# EAGLE schematic Mainboard (EAGLE 6.6.0)

## Sheet 1 of 4
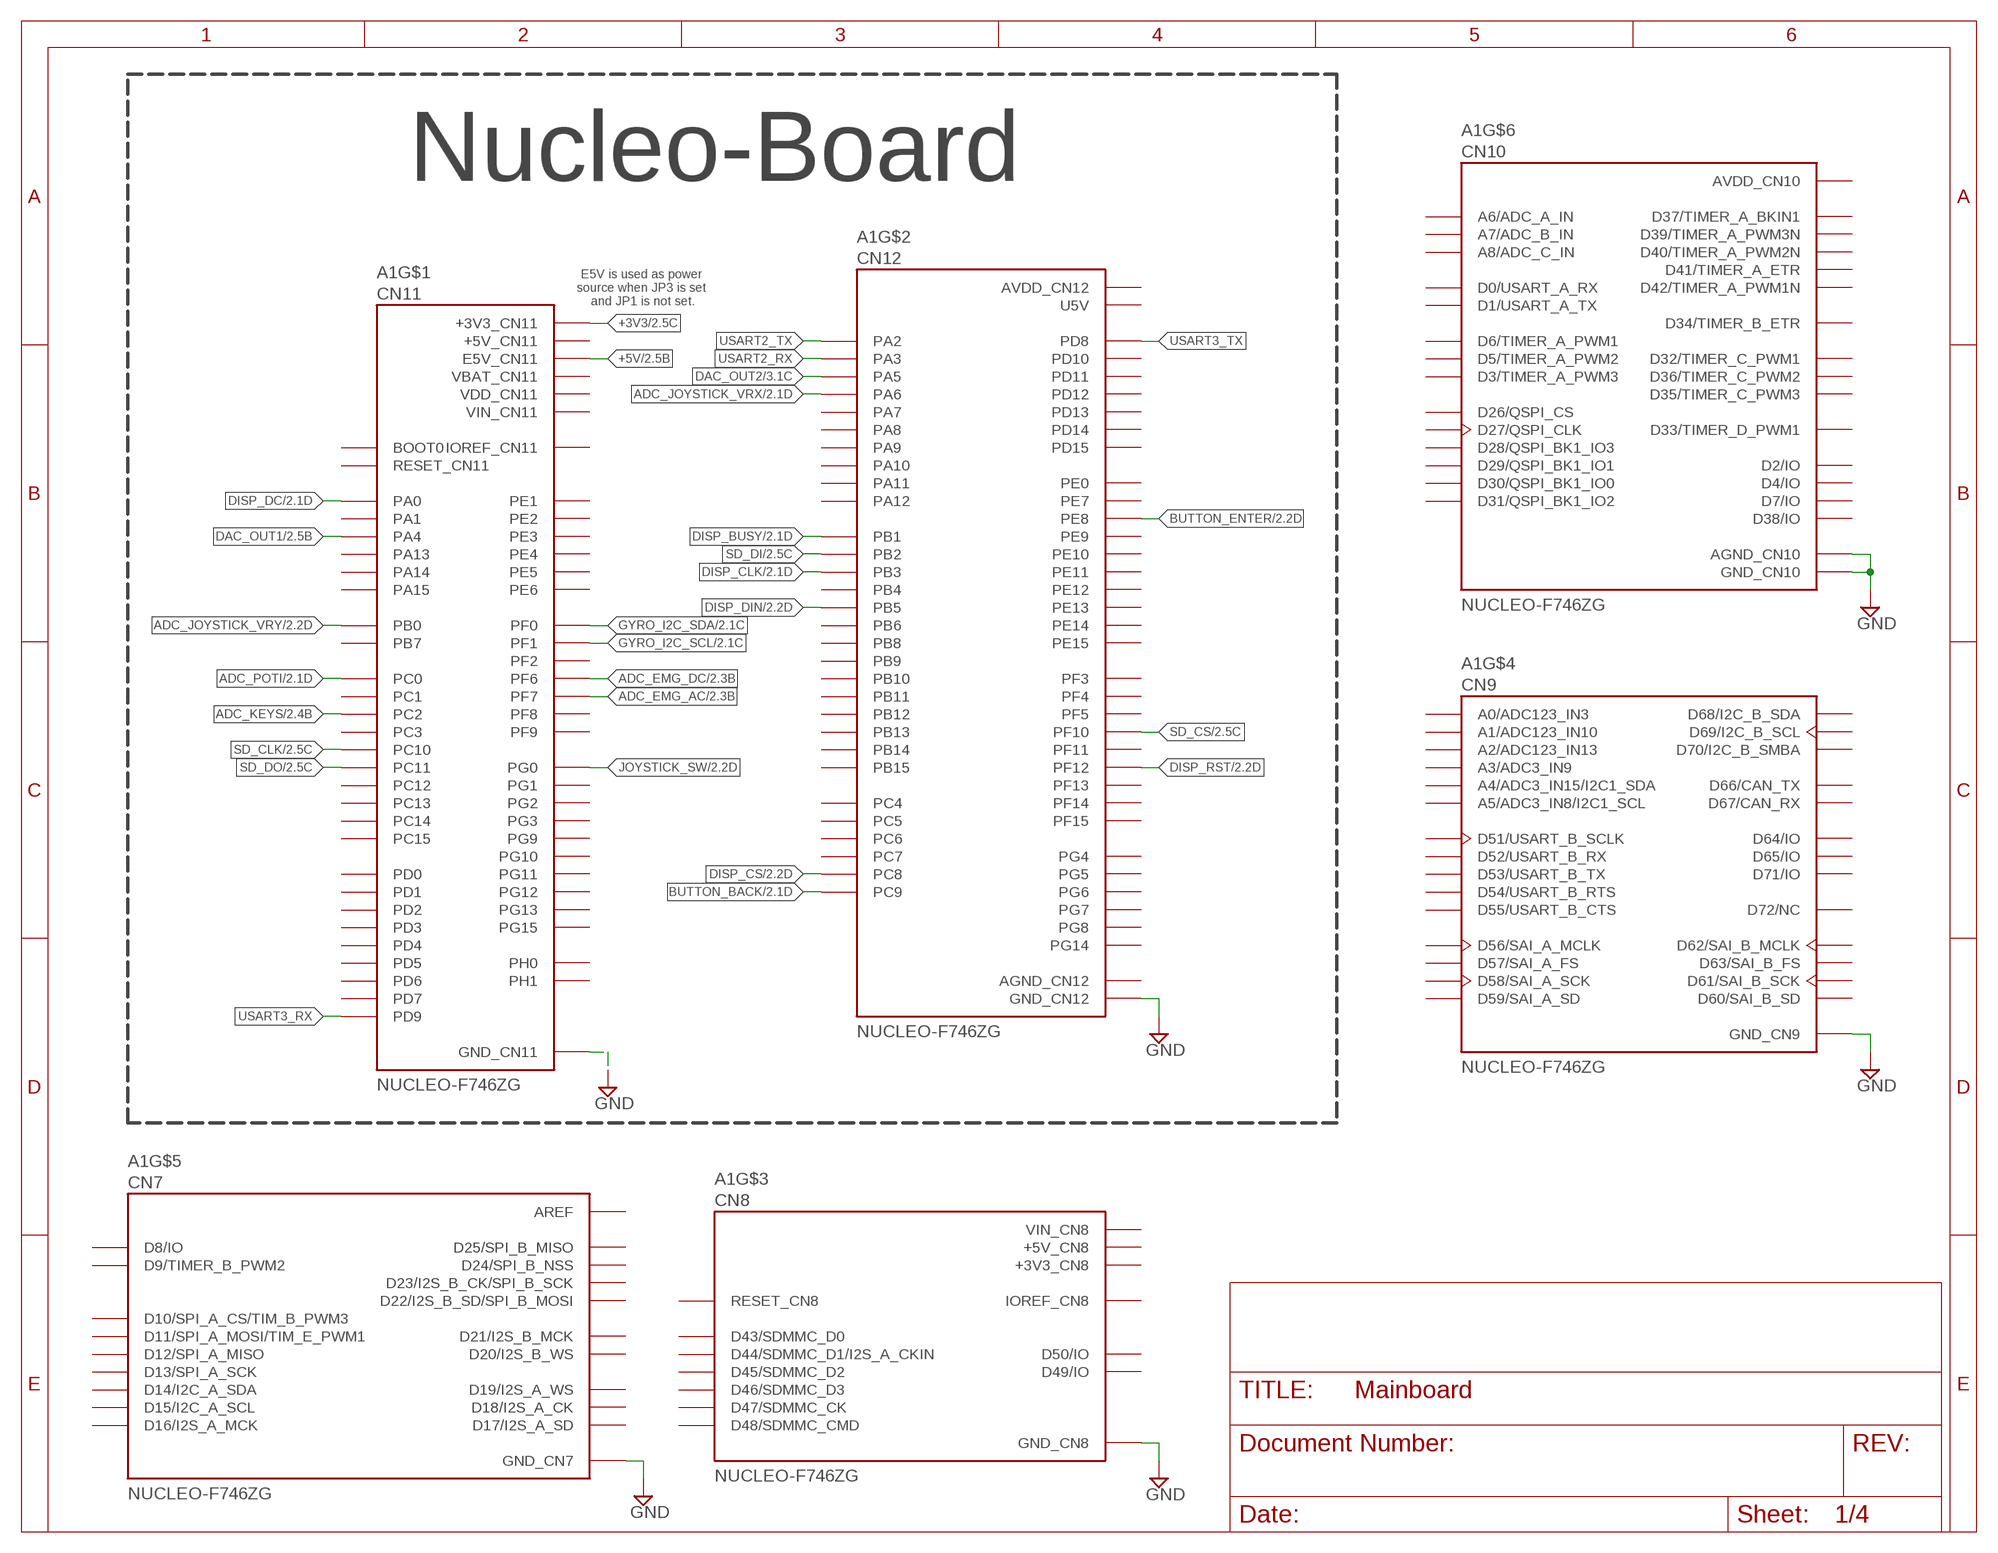
[diagram p0: schematic, sheet 1]

### Parts
A1  NUCLEO-F746ZG  [MODULE_NUCLEO-F746ZG]

### Nets
+3V3: A1.CN11_16(+3V3_CN11) ; also sheet 2,4
+5V: A1.CN11_6(E5V_CN11) ; also sheet 2,3,4
ADC_EMG_AC: A1.CN11_11(PF7) ; also sheet 2
ADC_EMG_DC: A1.CN11_9(PF6) ; also sheet 2
ADC_JOYSTICK_VRX: A1.CN12_13(PA6) ; also sheet 2,4
ADC_JOYSTICK_VRY: A1.CN11_34(PB0) ; also sheet 2,4
ADC_KEYS: A1.CN11_35(PC2) ; also sheet 2
ADC_POTI: A1.CN11_38(PC0) ; also sheet 2,4
BUTTON_BACK: A1.CN12_1(PC9) ; also sheet 2
BUTTON_ENTER: A1.CN12_40(PE8) ; also sheet 2
DAC_OUT1: A1.CN11_32(PA4) ; also sheet 2,3
DAC_OUT2: A1.CN12_11(PA5) ; also sheet 3
DISP_BUSY: A1.CN12_24(PB1) ; also sheet 2
DISP_CLK: A1.CN12_31(PB3) ; also sheet 2
DISP_CS: A1.CN12_2(PC8) ; also sheet 2
DISP_DC: A1.CN11_28(PA0) ; also sheet 2
DISP_DIN: A1.CN12_29(PB5) ; also sheet 2
DISP_RST: A1.CN12_59(PF12) ; also sheet 2
GND: A1.CN7_8(GND_CN7) A1.CN8_11(GND_CN8) A1.CN8_13(GND_CN8) A1.CN9_12(GND_CN9) A1.CN9_23(GND_CN9) A1.CN10_3(AGND_CN10) A1.CN10_5(GND_CN10) A1.CN10_17(GND_CN10) A1.CN10_22(GND_CN10) A1.CN10_27(GND_CN10) A1.CN11_8(GND_CN11) A1.CN11_19(GND_CN11) A1.CN11_20(GND_CN11) A1.CN11_22(GND_CN11) A1.CN11_49(GND_CN11) A1.CN11_60(GND_CN11) A1.CN11_71(GND_CN11) A1.CN11_72(GND_CN11) A1.CN12_9(GND_CN12) A1.CN12_20(GND_CN12) A1.CN12_39(GND_CN12) A1.CN12_54(GND_CN12) A1.CN12_63(GND_CN12) A1.CN12_71(GND_CN12) A1.CN12_72(GND_CN12) ; also sheet 2,3,4
GYRO_I2C_SCL: A1.CN11_51(PF1) ; also sheet 2
GYRO_I2C_SDA: A1.CN11_53(PF0) ; also sheet 2
JOYSTICK_SW: A1.CN11_59(PG0) ; also sheet 2
SD_CLK: A1.CN11_1(PC10) ; also sheet 2
SD_CS: A1.CN12_42(PF10) ; also sheet 2
SD_DI: A1.CN12_22(PB2) ; also sheet 2
SD_DO: A1.CN11_2(PC11) ; also sheet 2
USART2_RX: A1.CN12_37(PA3)
USART2_TX: A1.CN12_35(PA2)
USART3_RX: A1.CN11_69(PD9)
USART3_TX: A1.CN12_10(PD8)
Unconnected: A1.CN7_1(D16/I2S_A_MCK) A1.CN7_2(D15/I2C_A_SCL) A1.CN7_3(D17/I2S_A_SD) A1.CN7_4(D14/I2C_A_SDA) A1.CN7_5(D18/I2S_A_CK) A1.CN7_7(D19/I2S_A_WS) A1.CN7_9(D20/I2S_B_WS) A1.CN7_10(D13/SPI_A_SCK) A1.CN7_11(D21/I2S_B_MCK) A1.CN7_12(D12/SPI_A_MISO) A1.CN7_13(D22/I2S_B_SD/SPI_B_MOSI) A1.CN7_14(D11/SPI_A_MOSI/TIM_E_PWM1) A1.CN7_15(D23/I2S_B_CK/SPI_B_SCK) A1.CN7_16(D10/SPI_A_CS/TIM_B_PWM3) A1.CN7_17(D24/SPI_B_NSS) A1.CN7_18(D9/TIMER_B_PWM2) A1.CN7_19(D25/SPI_B_MISO) A1.CN7_20(D8/IO) A1.CN8_2(D43/SDMMC_D0) A1.CN8_3(IOREF_CN8) A1.CN8_4(D44/SDMMC_D1/I2S_A_CKIN) A1.CN8_5(RESET_CN8) A1.CN8_6(D45/SDMMC_D2) A1.CN8_8(D46/SDMMC_D3) A1.CN8_10(D47/SDMMC_CK) A1.CN8_12(D48/SDMMC_CMD) A1.CN8_14(D49/IO) A1.CN8_16(D50/IO) A1.CN9_1(A0/ADC123_IN3) A1.CN9_2(D51/USART_B_SCLK) A1.CN9_3(A1/ADC123_IN10) A1.CN9_4(D52/USART_B_RX) A1.CN9_5(A2/ADC123_IN13) A1.CN9_6(D53/USART_B_TX) A1.CN9_7(A3/ADC3_IN9) A1.CN9_8(D54/USART_B_RTS) A1.CN9_9(A4/ADC3_IN15/I2C1_SDA) A1.CN9_10(D55/USART_B_CTS) A1.CN9_11(A5/ADC3_IN8/I2C1_SCL) A1.CN9_13(D72/NC) A1.CN9_14(D56/SAI_A_MCLK) A1.CN9_15(D71/IO) A1.CN9_16(D57/SAI_A_FS) A1.CN9_17(D70/I2C_B_SMBA) A1.CN9_18(D58/SAI_A_SCK) A1.CN9_19(D69/I2C_B_SCL) A1.CN9_20(D59/SAI_A_SD) A1.CN9_21(D68/I2C_B_SDA) A1.CN9_22(D60/SAI_B_SD) A1.CN9_24(D61/SAI_B_SCK) A1.CN9_25(D67/CAN_RX) A1.CN9_26(D62/SAI_B_MCLK) A1.CN9_27(D66/CAN_TX) A1.CN9_28(D63/SAI_B_FS) A1.CN9_29(D65/IO) A1.CN9_30(D64/IO) A1.CN10_2(D7/IO) A1.CN10_4(D6/TIMER_A_PWM1) A1.CN10_6(D5/TIMER_A_PWM2) A1.CN10_7(A6/ADC_A_IN) A1.CN10_8(D4/IO) A1.CN10_9(A7/ADC_B_IN) A1.CN10_10(D3/TIMER_A_PWM3) A1.CN10_11(A8/ADC_C_IN) A1.CN10_12(D2/IO) A1.CN10_13(D26/QSPI_CS) A1.CN10_14(D1/USART_A_TX) A1.CN10_15(D27/QSPI_CLK) A1.CN10_16(D0/USART_A_RX) A1.CN10_18(D42/TIMER_A_PWM1N) A1.CN10_19(D28/QSPI_BK1_IO3) A1.CN10_20(D41/TIMER_A_ETR) A1.CN10_21(D29/QSPI_BK1_IO1) A1.CN10_23(D30/QSPI_BK1_IO0) A1.CN10_24(D40/TIMER_A_PWM2N) A1.CN10_25(D31/QSPI_BK1_IO2) A1.CN10_26(D39/TIMER_A_PWM3N) A1.CN10_28(D38/IO) A1.CN10_29(D32/TIMER_C_PWM1) A1.CN10_30(D37/TIMER_A_BKIN1) A1.CN10_31(D33/TIMER_D_PWM1) A1.CN10_32(D36/TIMER_C_PWM2) A1.CN10_33(D34/TIMER_B_ETR) A1.CN10_34(D35/TIMER_C_PWM3) A1.CN11_3(PC12) A1.CN11_4(PD2) A1.CN11_7(BOOT0) A1.CN11_12(IOREF_CN11) A1.CN11_13(PA13) A1.CN11_14(RESET_CN11) A1.CN11_15(PA14) A1.CN11_17(PA15) A1.CN11_21(PB7) A1.CN11_23(PC13) A1.CN11_25(PC14) A1.CN11_27(PC15) A1.CN11_29(PH0) A1.CN11_30(PA1) A1.CN11_31(PH1) A1.CN11_36(PC1) A1.CN11_37(PC3) A1.CN11_39(PD4) A1.CN11_40(PD3) A1.CN11_41(PD5) A1.CN11_42(PG2) A1.CN11_43(PD6) A1.CN11_44(PG3) A1.CN11_45(PD7) A1.CN11_46(PE2) A1.CN11_47(PE3) A1.CN11_48(PE4) A1.CN11_50(PE5) A1.CN11_52(PF2) A1.CN11_54(PF8) A1.CN11_55(PD1) A1.CN11_56(PF9) A1.CN11_57(PD0) A1.CN11_58(PG1) A1.CN11_61(PE1) A1.CN11_62(PE6) A1.CN11_63(PG9) A1.CN11_64(PG15) A1.CN11_65(PG12) A1.CN11_66(PG10) A1.CN11_68(PG13) A1.CN11_70(PG11) A1.CN12_3(PB8) A1.CN12_4(PC6) A1.CN12_5(PB9) A1.CN12_6(PC5) A1.CN12_12(PA12) A1.CN12_14(PA11) A1.CN12_15(PA7) A1.CN12_16(PB12) A1.CN12_17(PB6) A1.CN12_18(PB11) A1.CN12_19(PC7) A1.CN12_21(PA9) A1.CN12_23(PA8) A1.CN12_25(PB10) A1.CN12_26(PB15) A1.CN12_27(PB4) A1.CN12_28(PB14) A1.CN12_30(PB13) A1.CN12_33(PA10) A1.CN12_34(PC4) A1.CN12_36(PF5) A1.CN12_38(PF4) A1.CN12_41(PD13) A1.CN12_43(PD12) A1.CN12_44(PE7) A1.CN12_45(PD11) A1.CN12_46(PD14) A1.CN12_47(PE10) A1.CN12_48(PD15) A1.CN12_49(PE12) A1.CN12_50(PF14) A1.CN12_51(PE14) A1.CN12_52(PE9) A1.CN12_53(PE15) A1.CN12_55(PE13) A1.CN12_56(PE11) A1.CN12_57(PF13) A1.CN12_58(PF3) A1.CN12_60(PF15) A1.CN12_61(PG14) A1.CN12_62(PF11) A1.CN12_64(PE0) A1.CN12_65(PD10) A1.CN12_66(PG8) A1.CN12_67(PG7) A1.CN12_68(PG5) A1.CN12_69(PG4) A1.CN12_70(PG6)

### Notes on the sheet
- Nucleo-Board
- E5V is used as power 
  source when JP3 is set 
  and JP1 is not set.

## Sheet 2 of 4
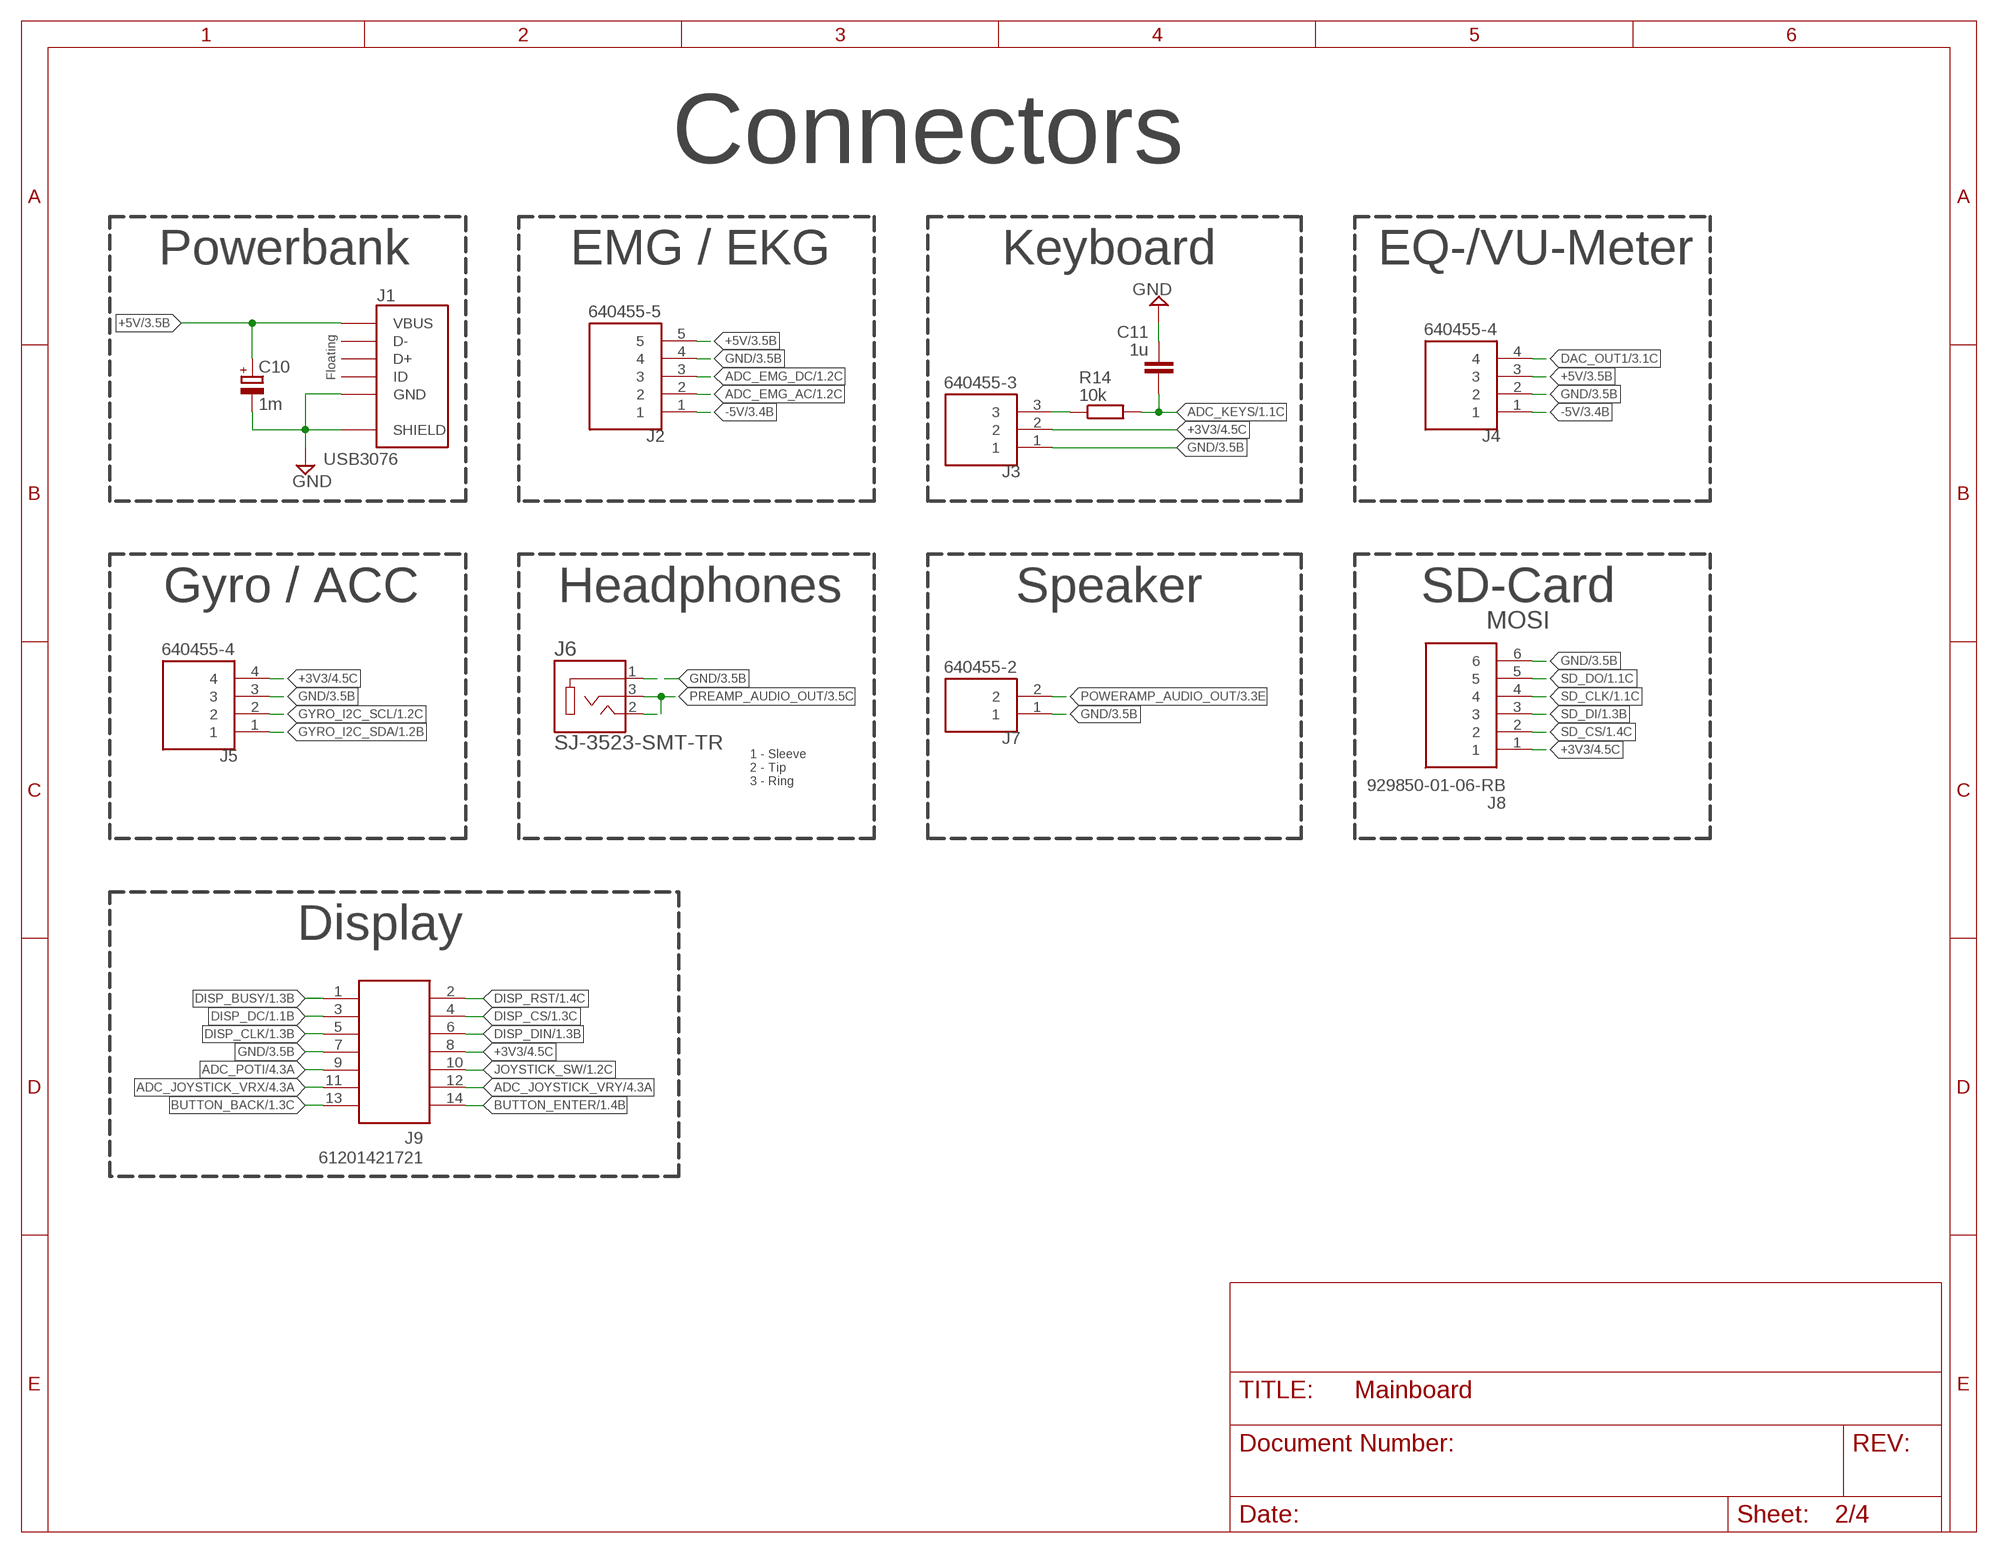
[diagram p1: schematic, sheet 2]

### Parts
C10  1m  CPOL-EUE2.5-5  [E2,5-5]
C11  1u  C-EUC0603  [C0603]
J1  USB3076  USB3076-XX-X_REVC  [GCT_USB3076-XX-X_REVC]
J2  640455-5  [TE_640455-5]
J3  640455-3  [TE_640455-3]
J4  640455-4  [TE_640455-4]
J5  640455-4  [TE_640455-4]
J6  SJ-3523-SMT-TR  [CUI_SJ-3523-SMT-TR]
J7  640455-2  [TE_640455-2]
J8  929850-01-06-RB  [RHDR6W76P0X254_1X6_1524X254X82]
J9  61201421721  [61201421721]
R14  10k  R-EU_R0603  [R0603]

### Nets
+3V3: J3.2 J5.4 J8.1 J9.8 ; also sheet 1,4
+5V: C10.+ J1.1(VBUS) J2.5 J4.3 ; also sheet 1,3,4
-5V: J2.1 J4.1 ; also sheet 3,4
ADC_EMG_AC: J2.2 ; also sheet 1
ADC_EMG_DC: J2.3 ; also sheet 1
ADC_JOYSTICK_VRX: J9.11 ; also sheet 1,4
ADC_JOYSTICK_VRY: J9.12 ; also sheet 1,4
ADC_KEYS: C11.1 R14.2 ; also sheet 1
ADC_POTI: J9.9 ; also sheet 1,4
BUTTON_BACK: J9.13 ; also sheet 1
BUTTON_ENTER: J9.14 ; also sheet 1
DAC_OUT1: J4.4 ; also sheet 1,3
DISP_BUSY: J9.1 ; also sheet 1
DISP_CLK: J9.5 ; also sheet 1
DISP_CS: J9.4 ; also sheet 1
DISP_DC: J9.3 ; also sheet 1
DISP_DIN: J9.6 ; also sheet 1
DISP_RST: J9.2 ; also sheet 1
GND: C10.- C11.2 J1.5(GND) J1.6(SHIELD) J1.7(SHIELD) J1.8(SHIELD) J1.9(SHIELD) J1.10(SHIELD) J1.11(SHIELD) J2.4 J3.1 J4.2 J5.3 J6.1 J7.1 J8.6 J9.7 ; also sheet 1,3,4
GYRO_I2C_SCL: J5.2 ; also sheet 1
GYRO_I2C_SDA: J5.1 ; also sheet 1
JOYSTICK_SW: J9.10 ; also sheet 1
N$1: J3.3 R14.1
POWERAMP_AUDIO_OUT: J7.2 ; also sheet 3
PREAMP_AUDIO_OUT: J6.2 J6.3 ; also sheet 3
SD_CLK: J8.4 ; also sheet 1
SD_CS: J8.2 ; also sheet 1
SD_DI: J8.3 ; also sheet 1
SD_DO: J8.5 ; also sheet 1
Unconnected: J1.2(D-) J1.3(D+) J1.4(ID)

### Notes on the sheet
- Connectors
- Powerbank | EMG / EKG | Keyboard | EQ-/VU-Meter
- Floating
- Gyro / ACC | Headphones | Speaker | SD-Card
- MOSI
- 1 - Sleeve
  2 - Tip
  3 - Ring
- Display

## Sheet 3 of 4
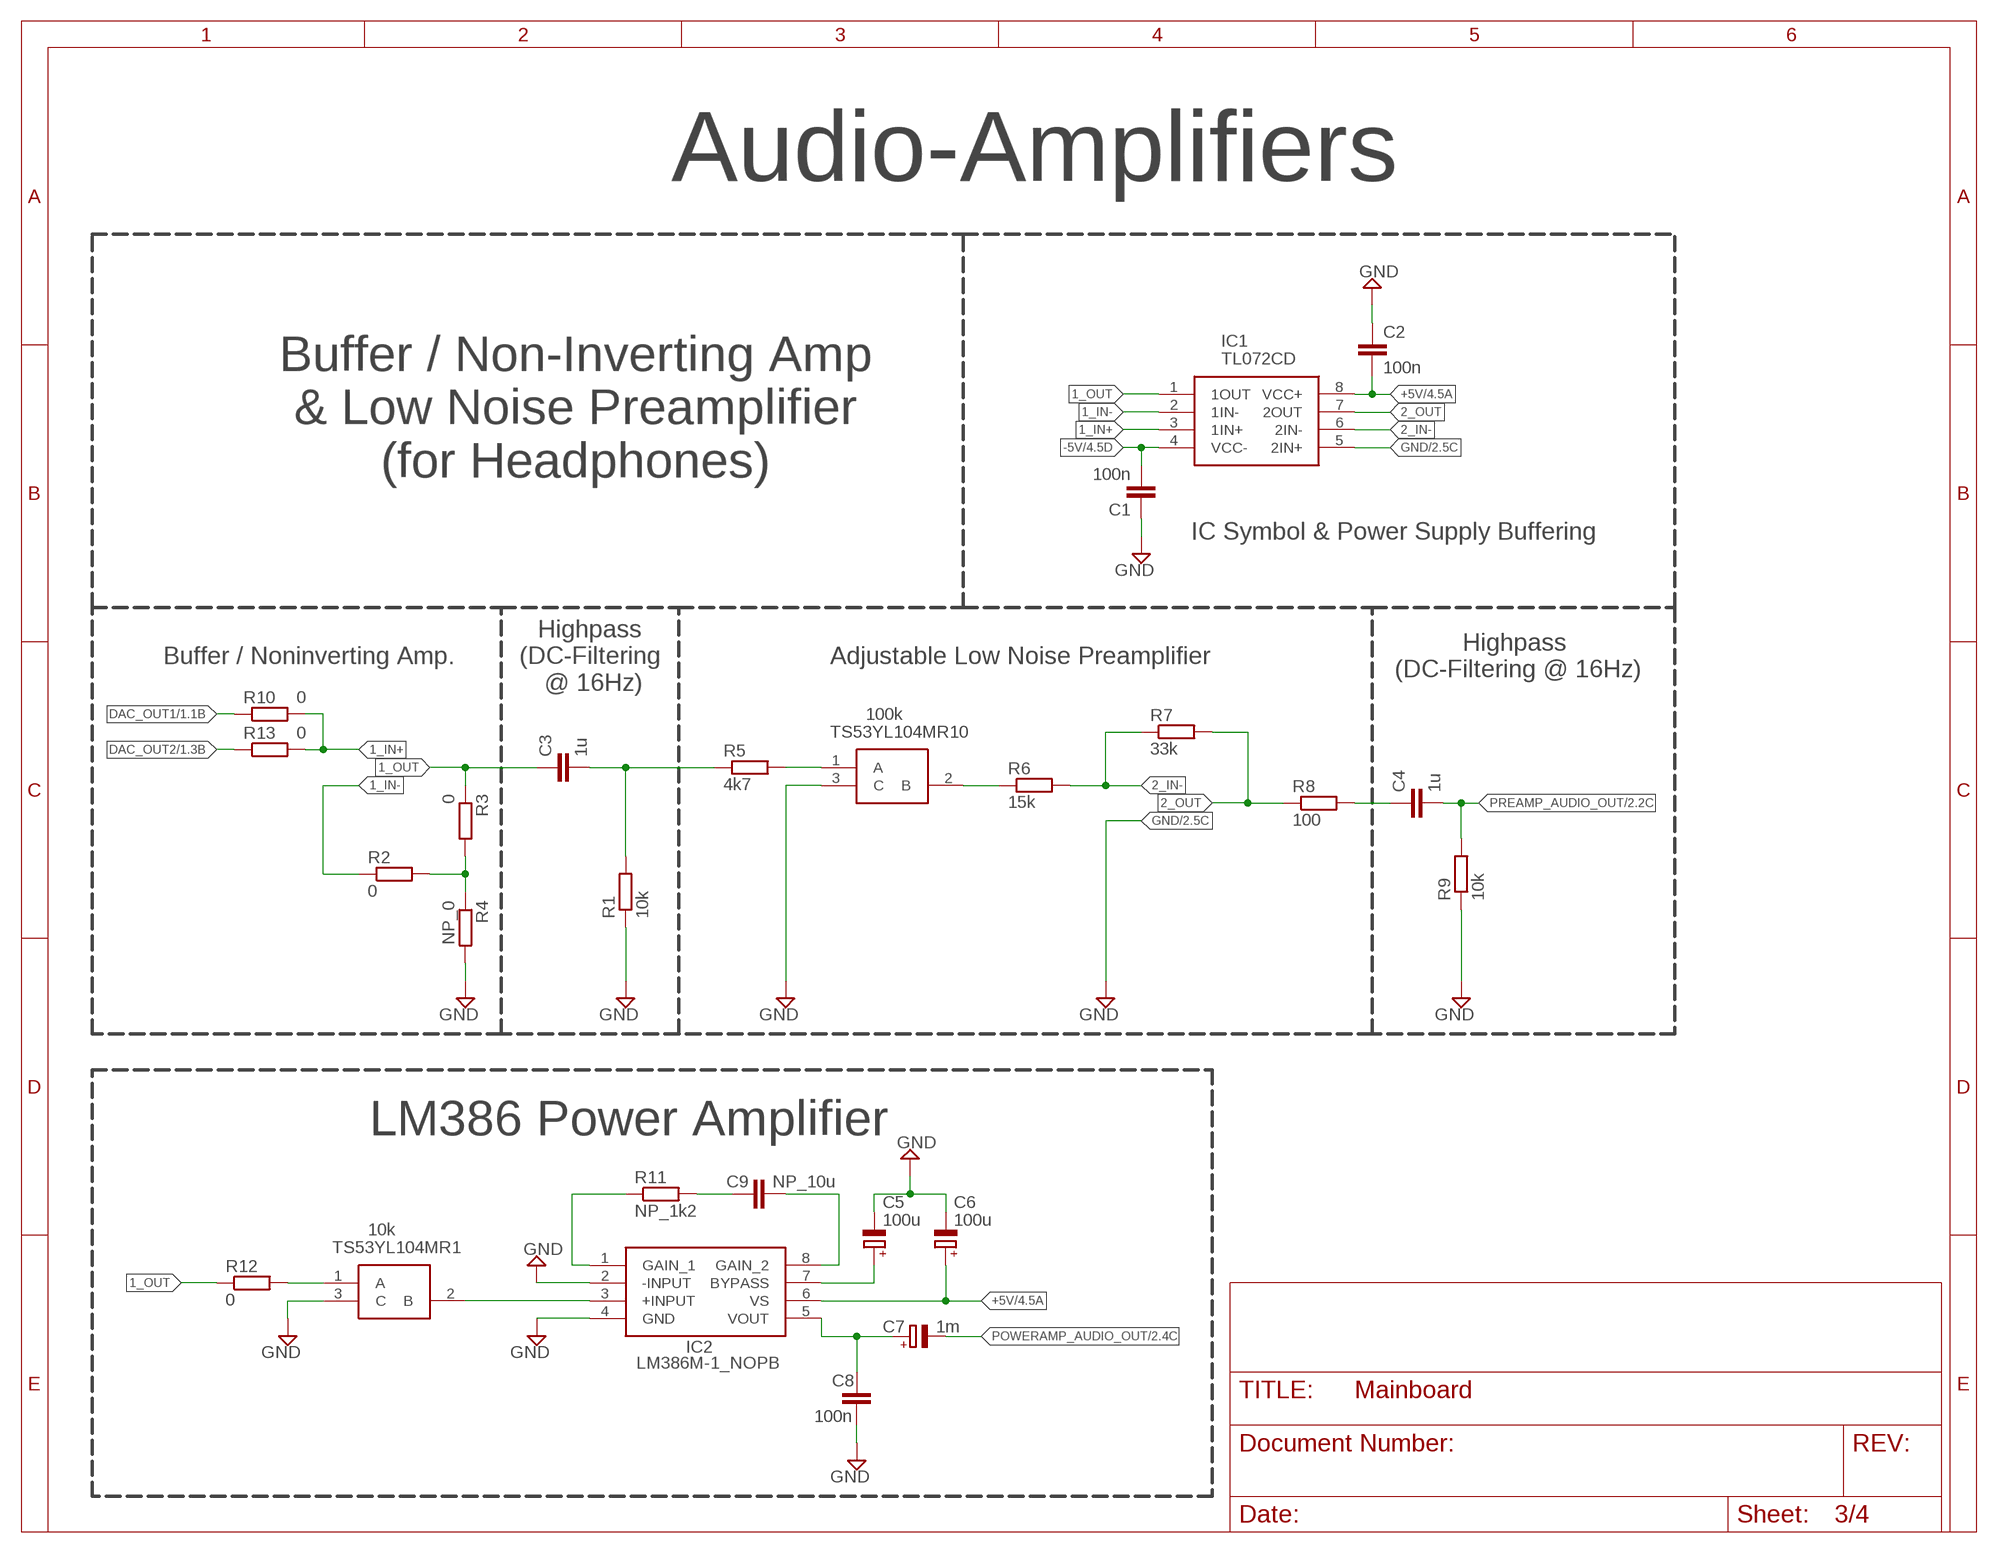
[diagram p2: schematic, sheet 3]

### Parts
C1  100n  C-EUC0603  [C0603]
C2  100n  C-EUC0603  [C0603]
C3  1u  C-EUC0603  [C0603]
C4  1u  C-EUC0603  [C0603]
C5  100u  CPOL-EUE2.5-5  [E2,5-5]
C6  100u  CPOL-EUE2.5-5  [E2,5-5]
C7  1m  CPOL-EUE2.5-5  [E2,5-5]
C8  100n  C-EUC0603  [C0603]
C9  NP_10u  C-EUC0603  [C0603]
IC1  TL072CD  [SOIC127P600X175-8N]
IC2  LM386M-1_NOPB  [SOIC127P600X175-8N]
R1  10k  R-EU_R0603  [R0603]
R2  0  R-EU_R0603  [R0603]
R3  0  R-EU_R0603  [R0603]
R4  NP_0  R-EU_R0603  [R0603]
R5  4k7  R-EU_R0603  [R0603]
R6  15k  R-EU_R0603  [R0603]
R7  33k  R-EU_R0603  [R0603]
R8  100  R-EU_R0603  [R0603]
R9  10k  R-EU_R0603  [R0603]
R10  0  R-EU_R0603  [R0603]
R11  NP_1k2  R-EU_R0603  [R0603]
R12  0  R-EU_R0603  [R0603]
R13  0  R-EU_R0603  [R0603]
TS53YL104MR1  10k  TS53YL203MR10  [TS53YL203MR10]
TS53YL104MR10  100k  TS53YL203MR10  [TS53YL203MR10]

### Nets
1_IN+: IC1.3(1IN+) R10.2 R13.2
1_IN-: IC1.2(1IN-) R2.1
1_OUT: C3.1 IC1.1(1OUT) R3.1 R12.1
2_IN-: IC1.6(2IN-) R6.2 R7.1
2_OUT: IC1.7(2OUT) R7.2 R8.1
+5V: C2.2 C6.+ IC1.8(VCC+) IC2.6(VS) ; also sheet 1,2,4
-5V: C1.2 IC1.4(VCC-) ; also sheet 2,4
DAC_OUT1: R10.1 ; also sheet 1,2
DAC_OUT2: R13.1 ; also sheet 1
GND: C1.1 C2.1 C5.- C6.- C8.2 IC1.5(2IN+) IC2.2(-INPUT) IC2.4(GND) R1.1 R4.2 R9.1 TS53YL104MR1.3(C) TS53YL104MR10.3(C) ; also sheet 1,2,4
N$2: C3.2 R1.2 R5.1
N$19: R2.2 R3.2 R4.1
N$20: R5.2 TS53YL104MR10.1(A)
N$21: R6.1 TS53YL104MR10.2(B)
N$22: C4.1 R8.2
N$23: IC2.1(GAIN_1) R11.1
N$24: IC2.3(+INPUT) TS53YL104MR1.2(B)
N$25: C9.1 R11.2
N$26: C9.2 IC2.8(GAIN_2)
N$27: R12.2 TS53YL104MR1.1(A)
N$28: C5.+ IC2.7(BYPASS)
N$29: C7.+ C8.1 IC2.5(VOUT)
POWERAMP_AUDIO_OUT: C7.- ; also sheet 2
PREAMP_AUDIO_OUT: C4.2 R9.2 ; also sheet 2

### Notes on the sheet
- Audio-Amplifiers
- Buffer / Non-Inverting Amp
  & Low Noise Preamplifier
  (for Headphones)
- IC Symbol & Power Supply Buffering
- Buffer / Noninverting Amp.
- Highpass 
  (DC-Filtering 
  @ 16Hz)
- Adjustable Low Noise Preamplifier
- Highpass 
  (DC-Filtering @ 16Hz)
- LM386 Power Amplifier

## Sheet 4 of 4
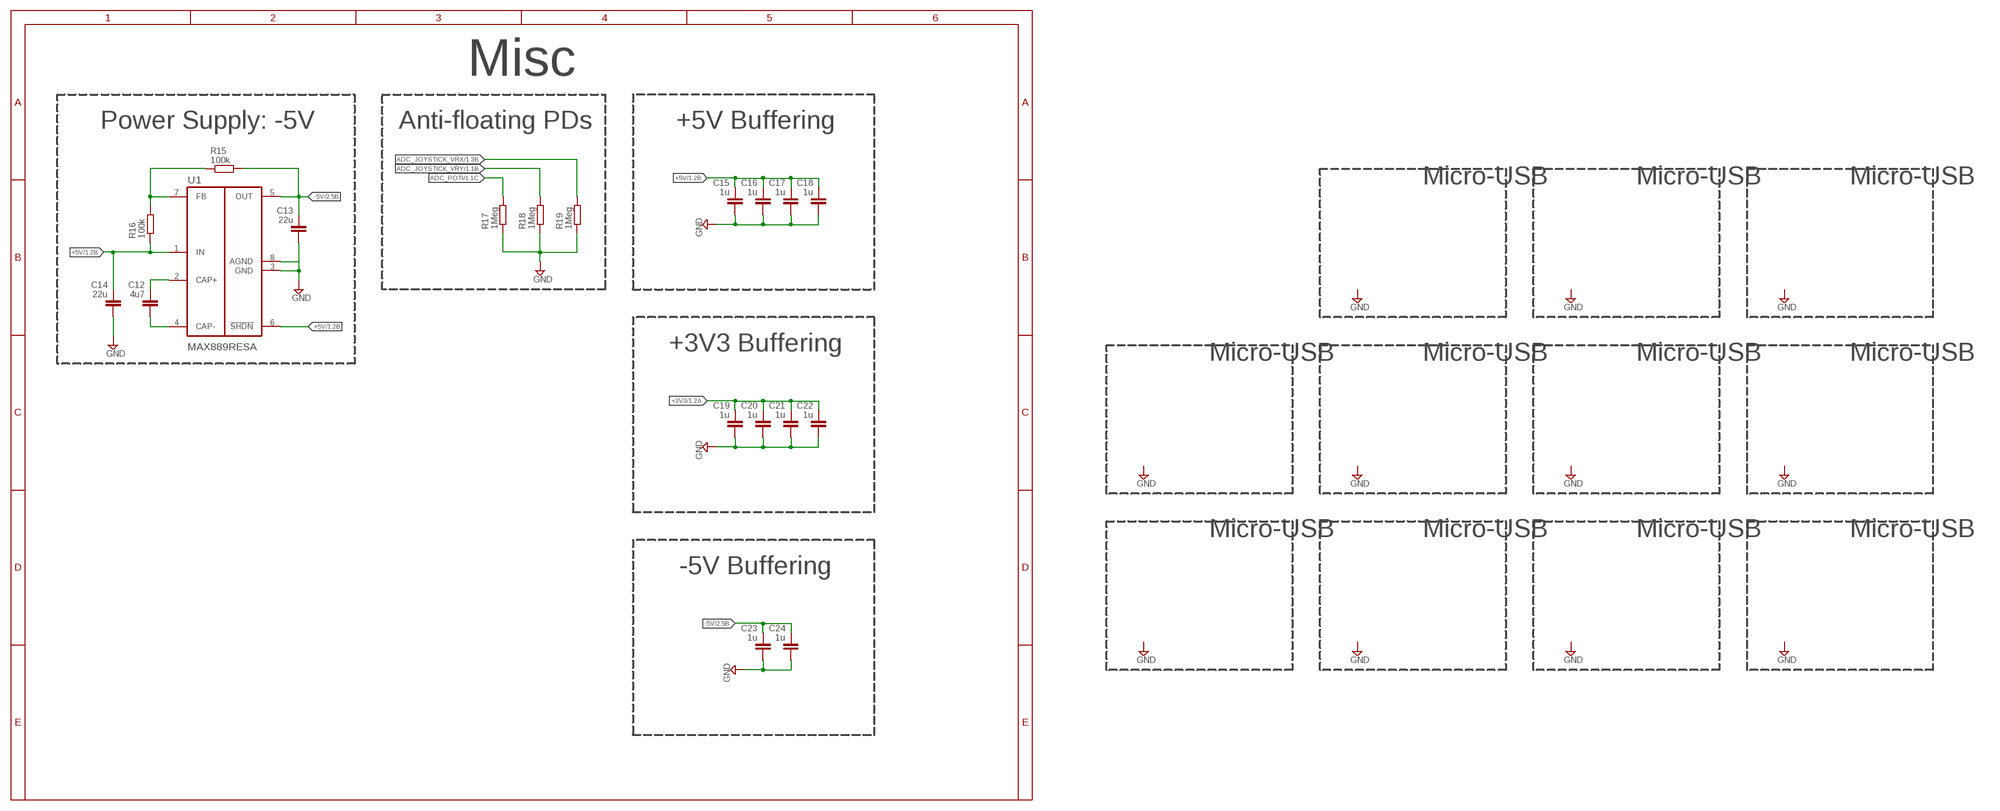
[diagram p3: schematic, sheet 4]

### Parts
C12  4u7  C-EUC0603  [C0603]
C13  22u  C-EUC0603  [C0603]
C14  22u  C-EUC0603  [C0603]
C15  1u  C-EUC0603  [C0603]
C16  1u  C-EUC0603  [C0603]
C17  1u  C-EUC0603  [C0603]
C18  1u  C-EUC0603  [C0603]
C19  1u  C-EUC0603  [C0603]
C20  1u  C-EUC0603  [C0603]
C21  1u  C-EUC0603  [C0603]
C22  1u  C-EUC0603  [C0603]
C23  1u  C-EUC0603  [C0603]
C24  1u  C-EUC0603  [C0603]
R15  100k  R-EU_R0603  [R0603]
R16  100k  R-EU_R0603  [R0603]
R17  1Meg  R-EU_R0603  [R0603]
R18  1Meg  R-EU_R0603  [R0603]
R19  1Meg  R-EU_R0603  [R0603]
U1  MAX889RESA  [SOIC127P600X175-8N]

### Nets
+3V3: C19.2 C20.2 C21.2 C22.2 ; also sheet 1,2
+5V: C14.2 C15.2 C16.2 C17.2 C18.2 R16.1 U1.1(IN) U1.6(!SHDN) ; also sheet 1,2,3
-5V: C13.2 C23.2 C24.2 R15.2 U1.5(OUT) ; also sheet 2,3
ADC_JOYSTICK_VRX: R19.2 ; also sheet 1,2
ADC_JOYSTICK_VRY: R18.2 ; also sheet 1,2
ADC_POTI: R17.2 ; also sheet 1,2
GND: C13.1 C14.1 C15.1 C16.1 C17.1 C18.1 C19.1 C20.1 C21.1 C22.1 C23.1 C24.1 R17.1 R18.1 R19.1 U1.3(GND) U1.8(AGND) ; also sheet 1,2,3
N$3: R15.1 R16.2 U1.7(FB)
N$5: C12.2 U1.2(CAP+)
N$6: C12.1 U1.4(CAP-)

### Notes on the sheet
- Misc
- Power Supply: -5V | Anti-floating PDs | +5V Buffering
- Micro-USB | Micro-USB | Micro-USB
- +3V3 Buffering
- Micro-USB | Micro-USB | Micro-USB | Micro-USB
- Micro-USB | Micro-USB | Micro-USB | Micro-USB
- -5V Buffering

## Power pins joined to a net without a drawn wire
+3V3_CN8: A1.CN8_7(+3V3_CN8)
+5V_CN8: A1.CN8_9(+5V_CN8)
+5V_CN11: A1.CN11_18(+5V_CN11)
AGND_CN12: A1.CN12_32(AGND_CN12)
AREF: A1.CN7_6(AREF)
AVDD_CN10: A1.CN10_1(AVDD_CN10)
AVDD_CN12: A1.CN12_7(AVDD_CN12)
U5V: A1.CN12_8(U5V)
VBAT_CN11: A1.CN11_33(VBAT_CN11)
VDD_CN11: A1.CN11_5(VDD_CN11)
VIN_CN8: A1.CN8_15(VIN_CN8)
VIN_CN11: A1.CN11_24(VIN_CN11)

## Library data of the parts
A1 = NUCLEO-F746ZG:NUCLEO-F746ZG: STM32 Nucleo-144 development board with STM32F746ZG MCU, supports Arduino, ST Zio and morpho connectivity Check prices <https://pricing.snapeda.com/parts/NUCLEO-F746ZG/STMicroelectronics/view-part?ref=eda>; AVAILABILITY: In Stock; DESCRIPTION: STM32F746ZG, mbed-Enabled Development Nucleo-144 STM32F7 ARM® Cortex®-M7 MCU 32-Bit Embedded Evaluation Board; MF: STMicroelectronics; MP: NUCLEO-F746ZG; PACKAGE: None; PRICE: None
C1-C4 C8 C9 C11-C24 = rcl:C-EU: CAPACITOR, European symbol
C5-C7 C10 = rcl:CPOL-EU: POLARIZED CAPACITOR, European symbol
IC1 = SamacSys_Parts:TL072CD: Dual Low-Noise JFET-Input General-Purpose Operational Amplifier Source: Datasheet <http://www.ti.com/lit/ds/symlink/tl072.pdf>; DESCRIPTION: Dual Low-Noise JFET-Input General-Purpose Operational Amplifier; HEIGHT: 1.75mm; MANUFACTURER_NAME: Texas Instruments; MANUFACTURER_PART_NUMBER: TL072CD; MOUSER_PART_NUMBER: 595-TL072CD; MOUSER_PRICE-STOCK: https://www.mouser.com/Search/Refine.aspx?Keyword=595-TL072CD
IC2 = SamacSys_Parts:LM386M-1_NOPB: Wide Input Voltage Low Power Audio Amplifier with Internal Gain Source: Datasheet; DESCRIPTION: Wide Input Voltage Low Power Audio Amplifier with Internal Gain; HEIGHT: 1.75mm; MANUFACTURER_NAME: Texas Instruments; MANUFACTURER_PART_NUMBER: LM386M-1/NOPB; MOUSER_PART_NUMBER: 926-LM386M-1/NOPB; MOUSER_PRICE-STOCK: https://www.mouser.co.uk/ProductDetail/Texas-Instruments/LM386M-1-NOPB?qs=QbsRYf82W3GaJvrwUmrW3g%3D%3D
J1 = USB3076-XX-X_REVC:USB3076-XX-X_REVC: Micro USB Receptacle, Type B, SMT, Horizontal, Bottom Mount w/out Peg, w/out Shell Stakes, w/out Mating Face Lead-In Check prices <https://pricing.snapeda.com/parts/USB3076-30-A/Global%20Connector%20Technology/view-part?ref=eda>; AVAILABILITY: In Stock; DESCRIPTION: USB - micro B USB 2.0 Receptacle Connector 5 Position Surface Mount, Right Angle; Through Hole, 2.35mm profile, 5 Pins, Horizontal, Bottom mount; MF: Global Connector Technology; MP: USB3076-30-A; PACKAGE: None; PRICE: None
J2 = 640455-5:640455-5; COMMENT: 640455-5; DESCRIPTION: MTA-100 5 Position Through Hole Single Row Right Angle Wire to Board Header; DIGI-KEY_PART_NUMBER: A19453-ND; DIGI-KEY_PURCHASE_URL: https://www.digikey.de/product-detail/en/te-connectivity-amp-connectors/640455-5/A19453-ND/259000?utm_source=snapeda&utm_medium=aggregator&utm_campaign=symbol; MF: TE Connectivity; MP: 640455-5; PACKAGE: None; TE_PURCHASE_URL: https://www.te.com/usa-en/product-640455-5.html?te_bu=Cor&te_type=disp&te_campaign=seda_glo_cor-seda-global-disp-prtnr-fy19-seda-model-bom-cta_sma-317_1&elqCampaignId=32493
J3 = 640455-3:640455-3: Check prices <https://pricing.snapeda.com/parts/640455-3/TE%20Connectivity/view-part?ref=eda>; AVAILABILITY: In Stock; COMMENT: 640455-3; DESCRIPTION: Connector Header Through Hole, Right Angle 3 position 0.100 (2.54mm); EU_ROHS_COMPLIANCE: Compliant; MF: TE Connectivity; MP: 640455-3; PACKAGE: None; PRICE: None; PURCHASE-URL: https://pricing.snapeda.com/search/part/640455-3/?ref=eda
J4 J5 = 640455-4:640455-4: Check prices <https://pricing.snapeda.com/parts/640455-4/TE%20Connectivity/view-part?ref=eda>; AVAILABILITY: In Stock; COMMENT: 640455-4; DESCRIPTION: Headers & Receptacles cable a placa 8 POS MONO SHAPE MKII TAB ASS'Y GW 750.N TYCO / TE CONNECTIVITY; EU_ROHS_COMPLIANCE: Compliant; MF: TE Connectivity; MP: 640455-4; PACKAGE: None; PRICE: None
J6 = SJ-3523-SMT-TR:SJ-3523-SMT-TR: Audio Jack Connector 3.5 mm Low Profile Surface Mount Stereo Jack, 3 Pin Right-Angle Check prices <https://pricing.snapeda.com/parts/SJ-3523-SMT-TR/CUI%20Devices/view-part?ref=eda>; AVAILABILITY: In Stock; CUI_PURCHASE_URL: https://www.cuidevices.com/product/interconnect/connectors/audio-connectors/jacks/sj-352x-smt-series?utm_source=snapeda.com&utm_medium=referral&utm_campaign=snapedaBOM; DESCRIPTION: 3.5 mm, Stereo, Right Angle, Surface Mount (SMT), 3 Conductors, 0~1 Internal Switches, Audio Jack Connector; MF: CUI Devices; MP: SJ-3523-SMT-TR; PACKAGE: LGA-10 STMicroelectronics; PRICE: None
J7 = 640455-2:640455-2: Check prices <https://pricing.snapeda.com/parts/640455-2/TE%20Connectivity/view-part?ref=eda>; AVAILABILITY: In Stock; COMMENT: 640455-2; DESCRIPTION: MTA-100 2 Position 2.54 mm Single Row Right Angle Wire to Board Header; EU_ROHS_COMPLIANCE: Compliant; MF: TE Connectivity; MP: 640455-2; PACKAGE: None; PRICE: None; PURCHASE-URL: https://pricing.snapeda.com/search/part/640455-2/?ref=eda
J8 = SamacSys_Parts:929850-01-06-RB: Headers & Wire Housings 6P STRT BRD MNT SKT 1 ROW 30MICRO" AU Source: Datasheet <https://www.mouser.fr/datasheet/2/1/ts0815-31700.pdf>; DESCRIPTION: Headers & Wire Housings 6P STRT BRD MNT SKT 1 ROW 30MICRO" AU; HEIGHT: 8.26mm; MANUFACTURER_NAME: 3M; MANUFACTURER_PART_NUMBER: 929850-01-06-RB; MOUSER_PART_NUMBER: 517-929850-01-06-RB; MOUSER_PRICE-STOCK: https://www.mouser.co.uk/ProductDetail/3M-Electronic-Solutions-Division/929850-01-06-RB?qs=s3by4FhMkp1OostaNDHGSw%3D%3D
J9 = 61201421721:61201421721: WR-BHD 2.54mm Male Angled Box Header, 14 Pins=>Code : Con_WTB_BHD_2.54_Male_THT_WS_61201421721 <http://katalog.we-online.de/media/thumbs2/eican/thb_Con_WTB_BHD_2.54_Male_THT_WS_6120xx21721_pf2.jpg> Details see: http://katalog.we-online.de/en/em/612_0xx_217_21 Created 2014-06-05, Karrer Zheng 2014 (C) Würth Elektronik Check prices <https://pricing.snapeda.com/parts/61201421721/W%C3%BCrth%20Elektronik/view-part?ref=eda>; AVAILABILITY: In Stock; DESCRIPTION: Connector Header Through Hole, Right Angle 14 position 0.100 (2.54mm); MF: Würth Elektronik; MP: 61201421721; PACKAGE: None; PRICE: None
R1-R19 = rcl:R-EU_: RESISTOR, European symbol
TS53YL104MR1 TS53YL104MR10 = SamacSys_Parts:TS53YL203MR10: Vishay TS53YL Series SMD Trimmer Resistor with Gull Wing Terminations, 20k +/-20% 1/4W +/-100ppm/C Top Adjust Source: Datasheet <https://componentsearchengine.com/Datasheets/1/TS53YL203MR10.pdf>; DESCRIPTION: Vishay TS53YL Series SMD Trimmer Resistor with Gull Wing Terminations, 20k +/-20% 1/4W +/-100ppm/C Top Adjust; HEIGHT: 2.7mm; MANUFACTURER_NAME: Vishay; MANUFACTURER_PART_NUMBER: TS53YL203MR10; MOUSER_PART_NUMBER: 72-TS53YL-20K; MOUSER_PRICE-STOCK: https://www.mouser.com/Search/Refine.aspx?Keyword=72-TS53YL-20K
U1 = MAX889RESA:MAX889RESA: Check prices <https://pricing.snapeda.com/parts/MAX889RESA%2B/Maxim%20Integrated/view-part?ref=eda>; AVAILABILITY: In Stock; DESCRIPTION: Charge Pump Switching Regulator IC Negative Adjustable -2.5V 1 Output 200mA 8-SOIC (0.154, 3.90mm Width); MF: Maxim Integrated; MP: MAX889RESA+; PACKAGE: SOIC-8 Maxim; PRICE: None